# EAGLE design Gfx_LCD (EAGLE 5.11)
TYPE: COG/NPO
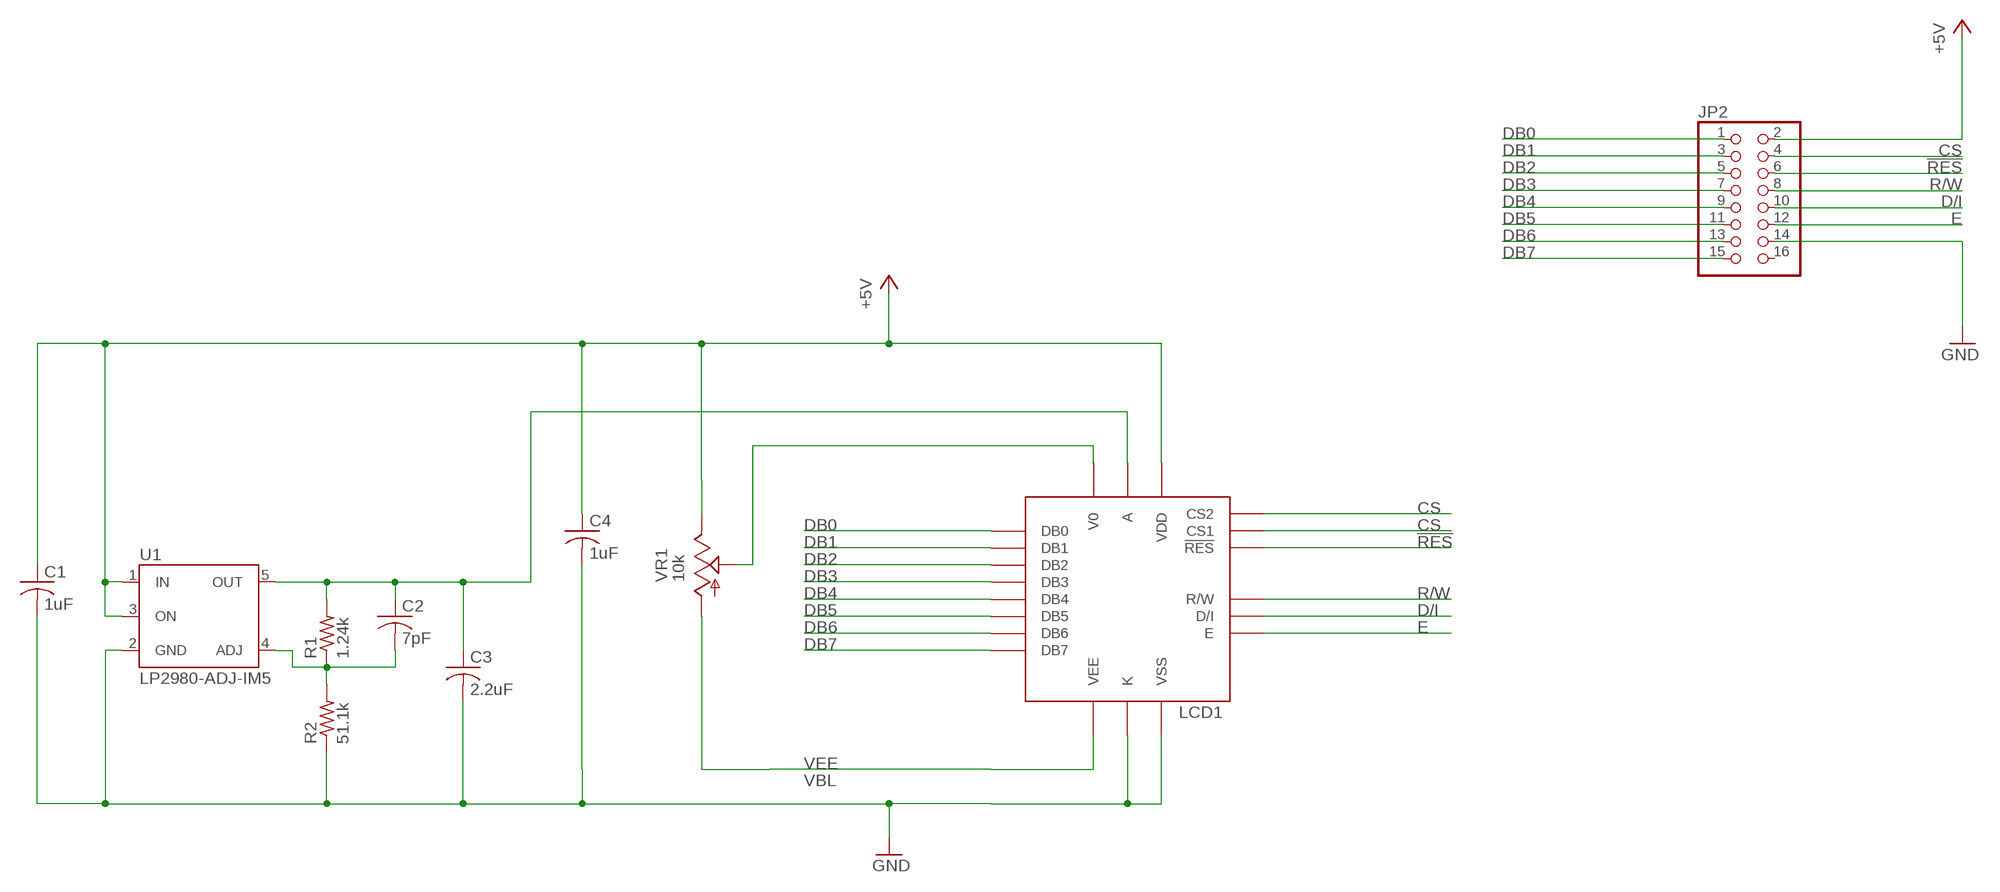
[diagram p0: schematic, sheet 1]

## Parts
C1  1uF  C-USC0603  [C0603]
C2  7pF  C-USC0603  [C0603]
C3  2.2uF  C-USC0603  [C0603]
C4  1uF  C-USC0603  [C0603]
JP2  PINHD-2X8  [2X08]
LCD1  GDM12864H  [GDM12864H]
R1  1.24k  R-US_R0603  [R0603]
R2  51.1k  R-US_R0603  [R0603]
U1  LP2980-ADJ-IM5  [SOT23-5]
VR1  10k  TRIM_US-CA6V  [CA6V]

## Nets
!RES: JP2.6 LCD1.P$14(!RES)
+5V: C1.1 C4.1 JP2.2 LCD1.P$1(VDD) U1.1(IN) U1.3(ON) VR1.E
CS: JP2.4 LCD1.P$12(CS2) LCD1.P$13(CS1)
D/I: JP2.10 LCD1.P$16(D/I)
DB0: JP2.1 LCD1.P$4(DB0)
DB1: JP2.3 LCD1.P$5(DB1)
DB2: JP2.5 LCD1.P$6(DB2)
DB3: JP2.7 LCD1.P$7(DB3)
DB4: JP2.9 LCD1.P$8(DB4)
DB5: JP2.11 LCD1.P$9(DB5)
DB6: JP2.13 LCD1.P$10(DB6)
DB7: JP2.15 LCD1.P$11(DB7)
E: JP2.12 LCD1.P$17(E)
GND: C1.2 C3.2 C4.2 JP2.14 LCD1.P$2(VSS) LCD1.P$20(K) R2.1 U1.2(GND)
N$1: C2.2 R1.1 R2.2 U1.4(ADJ)
R/W: JP2.8 LCD1.P$15(R/W)
V0: LCD1.P$3(V0) VR1.S
VBL: C2.1 C3.1 LCD1.P$19(A) R1.2 U1.5(OUT)
VEE: LCD1.P$18(VEE) VR1.A
Unconnected: JP2.16

## Library data of the parts
C1-C4 = rcl:C-US: CAPACITOR, American symbol
JP2 = pinhead:PINHD-2X8: PIN HEADER
LCD1 = mes:GDM12864H: GDM12864H Graphic LCD
R1 R2 = rcl:R-US_: RESISTOR, American symbol
U1 = mes_regulators:LP2980-ADJ: LP2980IM5-ADJ 50mA adjustable, ultra low drop out regulator in SOT-23-5 package
VR1 = pot:TRIM_US-: POTENTIOMETER

## Board
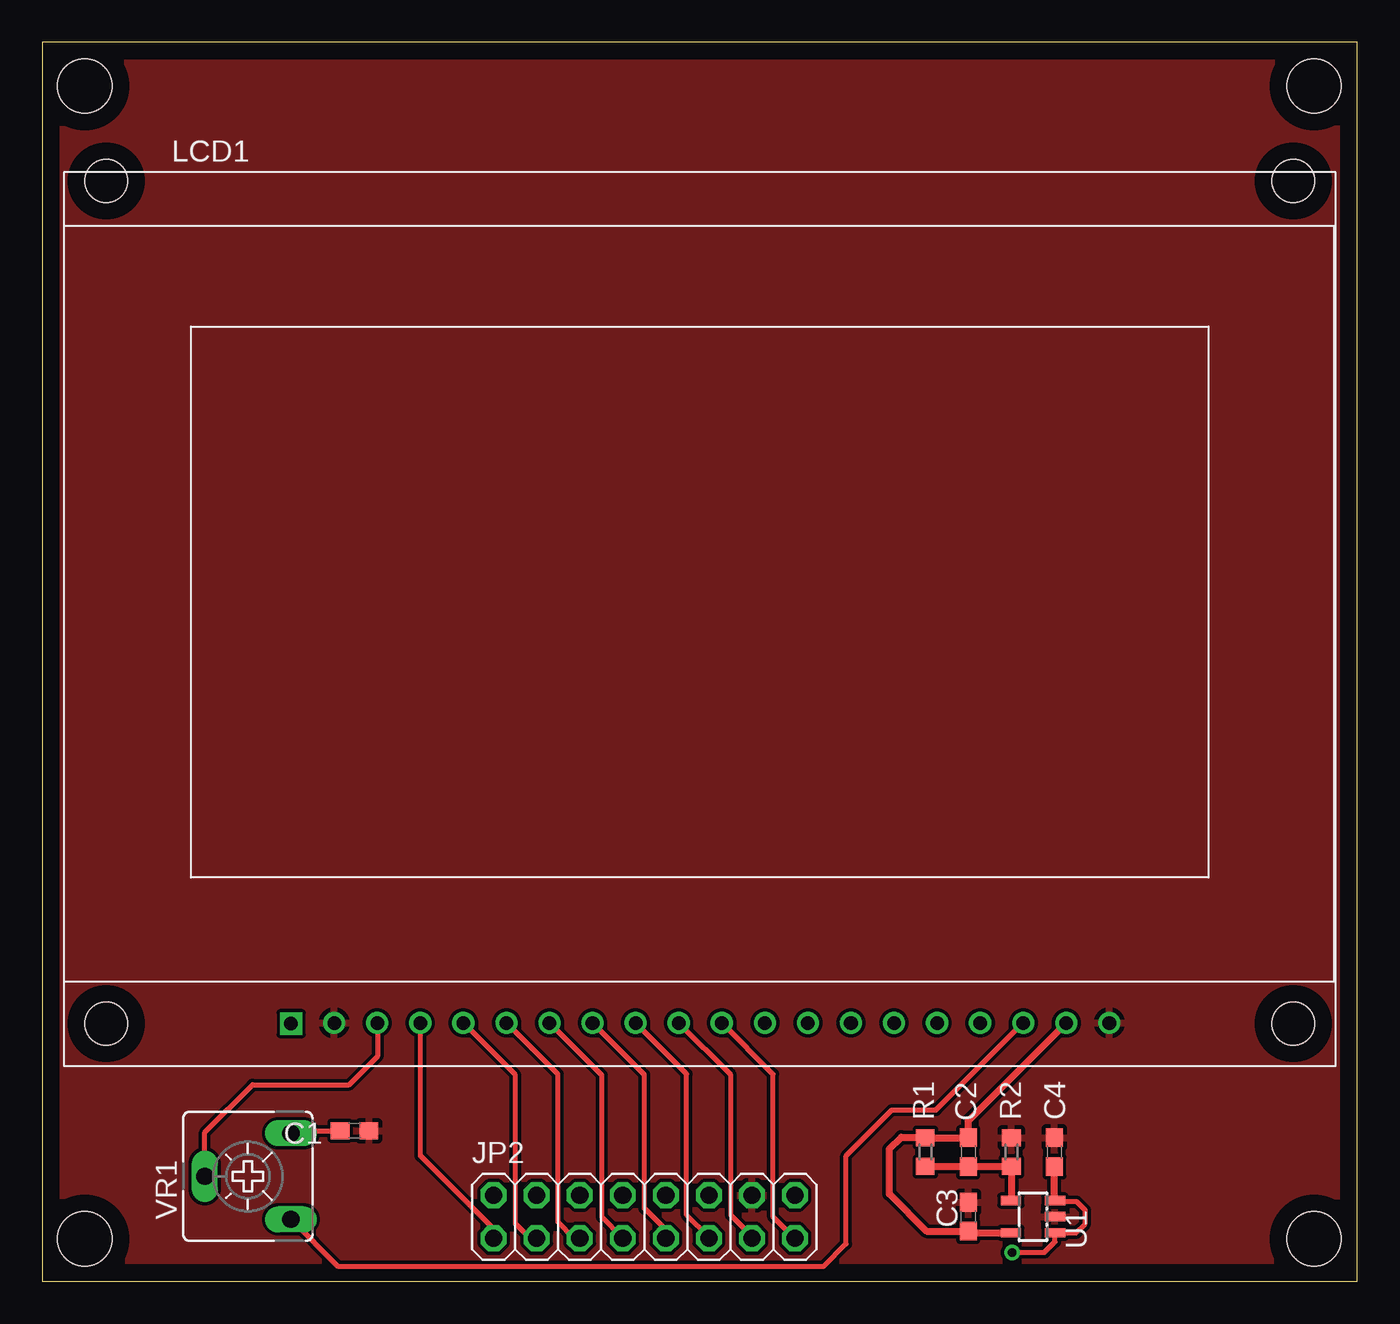
[diagram p1: board, top side]
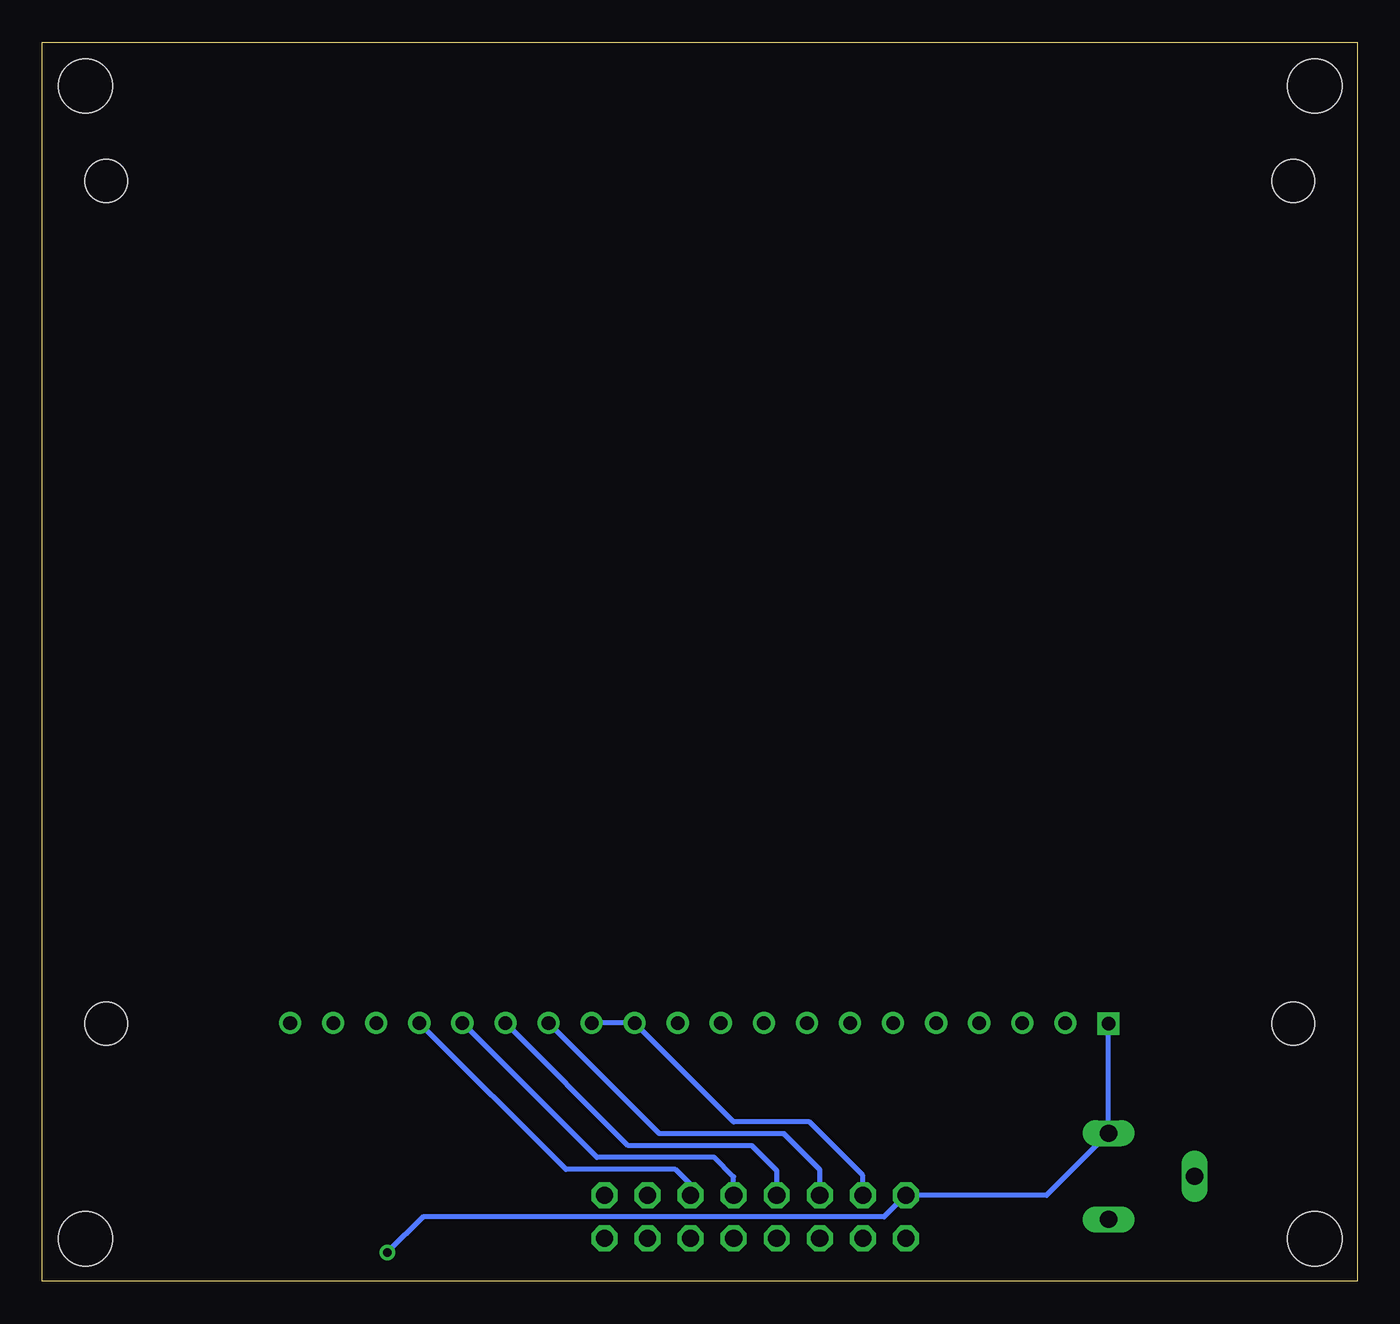
[diagram p2: board, bottom side, seen from below]

Size 77.54 x 73.07 mm. Coordinates in mm from the lower left corner, seen from the top.
Outline: 0,0 77.54,0 77.54,73.07 0,73.07 0,0
Copper layers (1*16): Top 0.035mm / dielectric 1.5mm / Bottom 0.035mm
Design rules "default": minimum track width 10mil, minimum drill 24mil, track to track 8mil, track to pad 8mil, pad to pad 8mil, via to via 8mil, smd to smd 8mil, copper to edge 40mil, drill to drill 8mil, minimum pad ring 10mil, minimum via ring 8mil, stop-mask expansion 4mil, vias tented up to drill 0mil, thermal gap 10mil
Holes 3.2 mm at 2.5,70.5 75,70.5 75,2.5 2.5,2.5

### Footprints (pad centres in the part's own frame; a part is rotated, then mirrored left to right if it is on the bottom)
C0603 = smd 1.1 x 1: 1 -0.85,0; 2 0.85,0
2X08 = drill 1.016 octagon: 1 -8.89,-1.27; 2 -8.89,1.27; 3 -6.35,-1.27; 4 -6.35,1.27; 5 -3.81,-1.27; 6 -3.81,1.27; 7 -1.27,-1.27; 8 -1.27,1.27; 9 1.27,-1.27; 10 1.27,1.27; 11 3.81,-1.27; 12 3.81,1.27; 13 6.35,-1.27; 14 6.35,1.27; 15 8.89,-1.27; 16 8.89,1.27
GDM12864H = drill 0.8 square: P$1 13.399,2.5 | drill 0.8 round: P$2 15.938,2.54; P$3 18.479,2.54; P$4 21.018,2.54; P$5 23.558,2.54; P$6 26.099,2.54; P$7 28.639,2.54; P$8 31.178,2.54; P$9 33.718,2.54; P$10 36.258,2.54; P$11 38.798,2.54; P$12 41.339,2.54; P$13 43.879,2.54; P$14 46.419,2.54; P$15 48.959,2.54; P$16 51.498,2.54; P$17 54.038,2.54; P$18 56.578,2.54; P$19 59.118,2.54; P$20 61.658,2.54 | hole 2.5: 2.5,2.5; 72.5,2.5; 2.5,52.2; 72.5,52.2
R0603 = smd 1 x 1.1: 1 -0.85,0; 2 0.85,0
SOT23-5 = smd 0.55 x 1.2: 1 -0.95,-1.3; 2 0,-1.3; 3 0.95,-1.3; 4 0.95,1.3; 5 -0.95,1.3
CA6V = drill 1.016 long: A -2.54,-2.54; E 2.54,-2.54; S 0,2.54

### Placement (x,y rotation side)
C1  18.41,8.88 0 top
C2  54.61,7.62 270 top
C3  54.61,3.81 90 top
C4  59.69,7.62 90 top
JP2  35.5,3.8 0 top
LCD1  1.27,12.7 0 top
R1  52.07,7.62 90 top
R2  57.15,7.62 270 top
U1  58.42,3.81 90 top
VR1  12.12,6.19 90 top

### Tracks (layer width: path | path; a pad name or v marks a point on that pad's centre or on a via)
!RES
  Bottom 0.305: JP2.6 31.69,6.59 33.8,8.7 41.15,8.7 LCD1.P$14
+5V  (via drill 0.5)
  Top 0.305: U1.3 59.78,4.7 61,4.7 61.5,4.2 61.5,3.4 60.96,2.86 U1.1 59.72,2.32 59.1,1.7 v57.2,1.7 | C4.1 | C1.1 14.81,8.88 VR1.E
  Top 0.406: U1.3 59.69,4.76 C4.1
  Bottom 0.305: LCD1.P$1 VR1.E 18.32,5.07 JP2.2 26.63,5.07 27.9,3.8 55.1,3.8 v57.2,1.7
CS
  Bottom 0.305: JP2.4 29.15,6.25 32.3,9.4 36.77,9.4 LCD1.P$12 LCD1.P$13
D/I
  Bottom 0.305: JP2.10 36.77,6.17 37.9,7.3 44.83,7.3 LCD1.P$16
DB0
  Top 0.305: JP2.1 26.61,3.09 22.3,7.4 22.3,15.23 LCD1.P$4
DB1
  Top 0.305: JP2.3 28.77,2.53 27.9,3.4 27.9,12.17 LCD1.P$5
DB2
  Top 0.305: JP2.5 31.37,2.53 30.4,3.5 30.4,12.21 LCD1.P$6
DB3
  Top 0.305: JP2.7 34.23,2.57 33,3.8 33,12.15 LCD1.P$7
DB4
  Top 0.305: JP2.9 36.77,3.03 35.5,4.3 35.5,12.19 LCD1.P$8
DB5
  Top 0.305: JP2.11 39.31,2.59 38,3.9 38,12.23 LCD1.P$9
DB6
  Top 0.305: JP2.13 41.85,2.65 40.6,3.9 40.6,12.17 LCD1.P$10
DB7
  Top 0.305: JP2.15 44.37,2.53 43.1,3.8 43.1,12.21 LCD1.P$11
E
  Bottom 0.305: JP2.12 39.31,5.71 40.2,6.6 46.67,6.6 LCD1.P$17
GND
  pour Top: 0,73.08 77.47,73.08 77.47,0 0,0
N$1
  Top 0.406: U1.4 57.15,4.76 R2.2 C2.2 R1.1
R/W
  Bottom 0.305: JP2.8 34.23,6.53 35.7,8 42.99,8 LCD1.P$15
V0
  Top 0.305: VR1.S 9.58,8.78 12.4,11.6 18.1,11.6 19.8,13.3 19.8,15.19 LCD1.P$3
VBL
  Top 0.406: U1.5 54.71,2.86 C3.1 52.14,2.96 49.95,5.15 49.95,7.8 50.65,8.5 52.04,8.5 R1.2 C2.1 54.61,9.46 LCD1.P$19
VEE
  Top 0.305: LCD1.P$18 52.7,10.1 50.1,10.1 47.4,7.4 47.4,2.2 46.1,0.9 17.41,0.9 VR1.A